# Altium schematic sheet D_Input.SchDoc
size A4; SheetNumber: 9; SheetTotal: 9
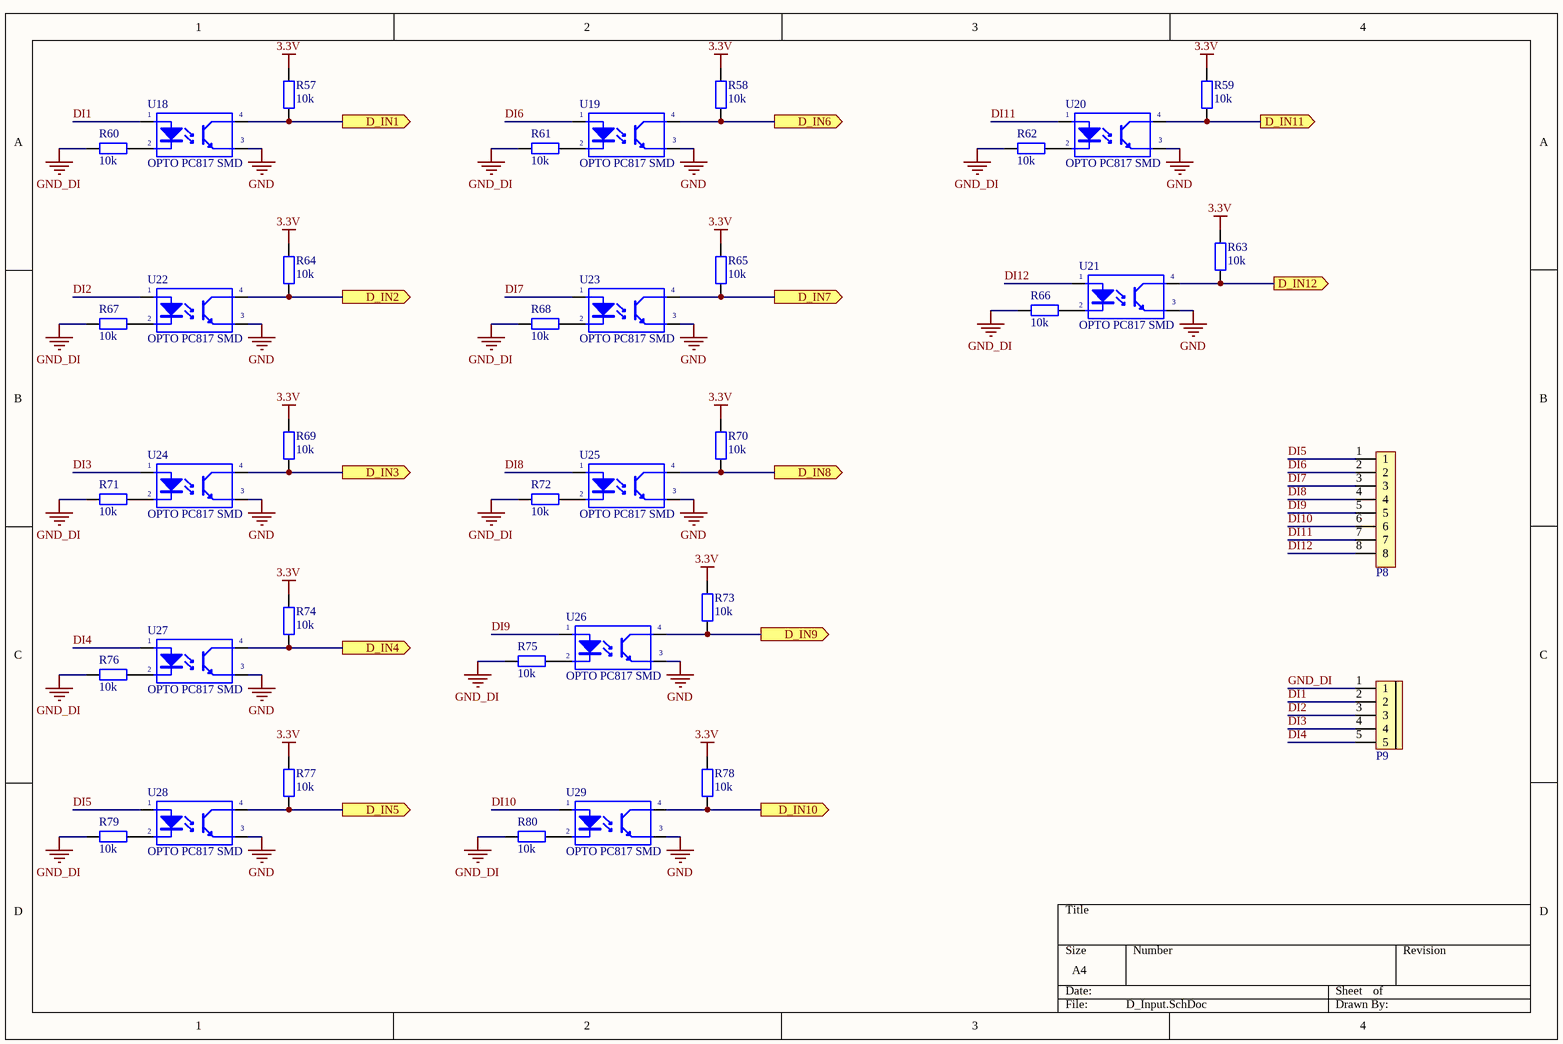
[diagram p0: D_Input.SchDoc]

## Parts
P8  CON 8 EDG5.08  [CON 8 8EDG5.08]  (value not drawn)
P9  CON 5 EDG5.08  [CON 5 5EDG5.08]  (value not drawn)
R57  10k  [tro smd 0603]
R58  10k  [tro smd 0603]
R59  10k  [tro smd 0603]
R60  10k  [tro smd 0603]
R61  10k  [tro smd 0603]
R62  10k  [tro smd 0603]
R63  10k  [tro smd 0603]
R64  10k  [tro smd 0603]
R65  10k  [tro smd 0603]
R66  10k  [tro smd 0603]
R67  10k  [tro smd 0603]
R68  10k  [tro smd 0603]
R69  10k  [tro smd 0603]
R70  10k  [tro smd 0603]
R71  10k  [tro smd 0603]
R72  10k  [tro smd 0603]
R73  10k  [tro smd 0603]
R74  10k  [tro smd 0603]
R75  10k  [tro smd 0603]
R76  10k  [tro smd 0603]
R77  10k  [tro smd 0603]
R78  10k  [tro smd 0603]
R79  10k  [tro smd 0603]
R80  10k  [tro smd 0603]
U18  OPTO PC817 SMD  [SOP4]
U19  OPTO PC817 SMD  [SOP4]
U20  OPTO PC817 SMD  [SOP4]
U21  OPTO PC817 SMD  [SOP4]
U22  OPTO PC817 SMD  [SOP4]
U23  OPTO PC817 SMD  [SOP4]
U24  OPTO PC817 SMD  [SOP4]
U25  OPTO PC817 SMD  [SOP4]
U26  OPTO PC817 SMD  [SOP4]
U27  OPTO PC817 SMD  [SOP4]
U28  OPTO PC817 SMD  [SOP4]
U29  OPTO PC817 SMD  [SOP4]

## Ports
D_IN1 (out), D_IN2 (out), D_IN3 (out), D_IN4 (out), D_IN5 (out), D_IN6 (out), D_IN7 (out), D_IN8 (out), D_IN9 (out), D_IN10 (out), D_IN11 (out), D_IN12 (out)

## Nets
3.3V: R57.2 R58.2 R59.2 R63.2 R64.2 R65.2 R69.2 R70.2 R73.2 R74.2 R77.2 R78.2
GND: U18.3(E) U19.3(E) U20.3(E) U21.3(E) U22.3(E) U23.3(E) U24.3(E) U25.3(E) U26.3(E) U27.3(E) U28.3(E) U29.3(E)
GND_DI: P9.1 R60.2 R61.2 R62.2 R66.2 R67.2 R68.2 R71.2 R72.2 R75.2 R76.2 R79.2 R80.2
D_IN1: R57.1 U18.4(C) ; port D_IN1
D_IN2: R64.1 U22.4(C) ; port D_IN2
D_IN3: R69.1 U24.4(C) ; port D_IN3
D_IN4: R74.1 U27.4(C) ; port D_IN4
D_IN5: R77.1 U28.4(C) ; port D_IN5
D_IN6: R58.1 U19.4(C) ; port D_IN6
D_IN7: R65.1 U23.4(C) ; port D_IN7
D_IN8: R70.1 U25.4(C) ; port D_IN8
D_IN9: R73.1 U26.4(C) ; port D_IN9
D_IN10: R78.1 U29.4(C) ; port D_IN10
D_IN11: R59.1 U20.4(C) ; port D_IN11
D_IN12: R63.1 U21.4(C) ; port D_IN12
DI1: P9.2 U18.1(A)
DI2: P9.3 U22.1(A)
DI3: P9.4 U24.1(A)
DI4: P9.5 U27.1(A)
DI5: P8.1 U28.1(A)
DI6: P8.2 U19.1(A)
DI7: P8.3 U23.1(A)
DI8: P8.4 U25.1(A)
DI9: P8.5 U26.1(A)
DI10: P8.6 U29.1(A)
DI11: P8.7 U20.1(A)
DI12: P8.8 U21.1(A)
NetR60_1: R60.1 U18.2(K)
NetR61_1: R61.1 U19.2(K)
NetR62_1: R62.1 U20.2(K)
NetR66_1: R66.1 U21.2(K)
NetR67_1: R67.1 U22.2(K)
NetR68_1: R68.1 U23.2(K)
NetR71_1: R71.1 U24.2(K)
NetR72_1: R72.1 U25.2(K)
NetR75_1: R75.1 U26.2(K)
NetR76_1: R76.1 U27.2(K)
NetR79_1: R79.1 U28.2(K)
NetR80_1: R80.1 U29.2(K)

## Library data of the parts
P8 = CON 8 EDG5.08: Cắm; Ten_Linh_Kien: CON 8 2EDG5.08-8P 5.08MM ( Xanh Cong); Ma_Hang: MH000978; Don_Vi: Con; Ghi_Chu: *; Kieu_Chan: *; Chung_Loai: Cắm
P9 = CON 5 EDG5.08: Cắm; Ten_Linh_Kien: CON 5 2EDG5.08-5P 5.08MM ( Xanh Cong); Ma_Hang: MH003589; Kieu_Chan: *; Don_Vi: Con; Ghi_Chu: *; Chung_Loai: Cắm
R57-R80 = Tro 0603 5% 10k: Dán; Don_Vi: Con; So_Chan: 2; Ten_Linh_Kien: Trở 0603 5% 10k; Ma_Hang: MH006316; Chung_Loai: Dán; Kieu_Chan: *
U18-U29 = OPTO PC817 SMD: Single Opto; Value: PC817